# Altium schematic sheet LIN_SCH.SchDoc: Transceiver LIN
size A4; Author: **; CompanyName: Electrónica Aplicada al Automotor; Organization: UTN FRBA; DocumentNumber: 7; Revision: 00; SheetNumber: 7; SheetTotal: 7; Autor: Badenas, Francisco J. / Ipar, Eugenia
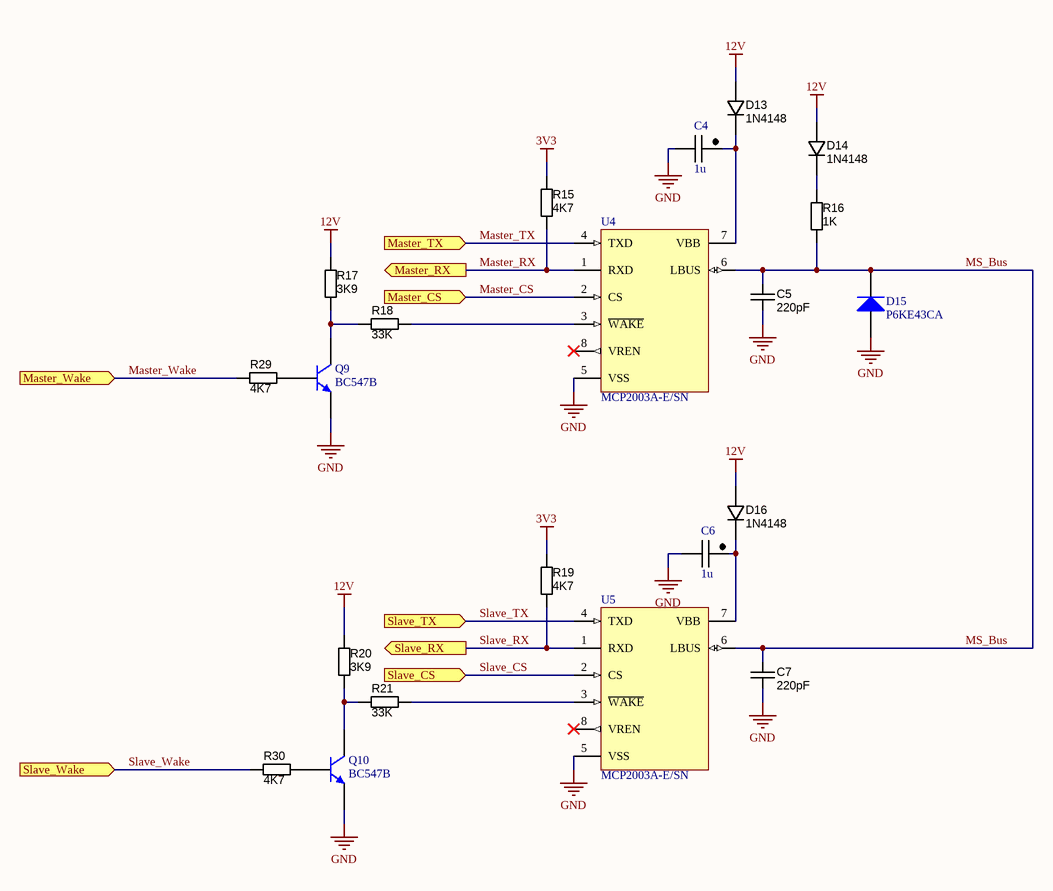
[diagram p0: LIN_SCH.SchDoc]

## Parts
C4  1u  [CAP_Elec_5x5.7]
C5  220pF  [CAPC1608X90N]
C6  1u  [CAP_Elec_5x5.7]
C7  220pF  [CAPC1608X90N]
D13  1N4148  [SOD523F]
D14  1N4148  [SOD523F]
D15  P6KE43CA  [DO-41]
D16  1N4148  [SOD523F]
Q9  BC547B  [TO-92A]
Q10  BC547B  [TO-92A]
R15  4K7  [RESC1608N_ZERO]
R16  1K  [RESC1608N_ZERO]
R17  3K9  [RESC1608N_ZERO]
R18  33K  [RESC1608N_ZERO]
R19  4K7  [RESC1608N_ZERO]
R20  3K9  [RESC1608N_ZERO]
R21  33K  [RESC1608N_ZERO]
R29  4K7  [RESC1608N_ZERO]
R30  4K7  [RESC1608N_ZERO]
U4  MCP2003A-E/SN  [SOIC-SN8_N]
U5  MCP2003A-E/SN  [SOIC-SN8_N]

## Ports
Master_CS (in), Master_RX (out), Master_TX (in), Master_Wake (in), Slave_CS (in), Slave_RX (out), Slave_TX (in), Slave_Wake (in)

## Nets
3V3: R15.1 R19.1
12V: D13.A D14.A D16.A R17.1 R20.1
GND: C4.2 C5.2 C6.2 C7.2 D15.1(A) Q9.1(E) Q10.1(E) U4.5(VSS) U5.5(VSS)
Master_CS: U4.2(CS) ; port Master_CS
Master_RX: R15.2 U4.1(RXD) ; port Master_RX
Master_TX: U4.4(TXD) ; port Master_TX
Master_Wake: R29.1 ; port Master_Wake
MS_Bus: C5.1 C7.1 D15.2(K) R16.2 U4.6(LBUS) U5.6(LBUS)
Slave_CS: U5.2(CS) ; port Slave_CS
Slave_RX: R19.2 U5.1(RXD) ; port Slave_RX
Slave_TX: U5.4(TXD) ; port Slave_TX
Slave_Wake: R30.1 ; port Slave_Wake
NetC4_1: C4.1 D13.K U4.7(VBB)
NetC6_1: C6.1 D16.K U5.7(VBB)
NetD14_K: D14.K R16.1
NetQ9_2: Q9.2(B) R29.2
NetQ9_3: Q9.3(C) R17.2 R18.1
NetQ10_2: Q10.2(B) R30.2
NetQ10_3: Q10.3(C) R20.2 R21.1
NetR18_2: R18.2 U4.3(~{WAKE})
NetR21_2: R21.2 U5.3(~{WAKE})

Not connected (* = marked no-connect by the designer): U4 8(VREN)*; U5 8(VREN)*

## Notes on the sheet
- Title:
- Size:
- Author:
- A4
- Sheet
- of
- Revision:
- File:
- Date:

## Library data of the parts
C4 C6 = CAP_Elec_4x4
C5 C7 = CAPC_47n_0603_X7R_50V_10%: Capacitor SMD Cer 220pF 10% 50V X7R 0603; Manufacturer 1: AVX Corporation; Manufacturer Part Number 1: 06035C473KAT2A; Ratings: 50V; X7R; Material: ceramic; SCDType: spec; Manufacturer 3: Samsung; Manufacturer Part Number 3: CL10B473KBN; Package / Case: 0603 (1608 metric); Tolerance: ±10%; Supplier 1: Digi-Key; Supplier Part Number 1: 478-5146-1-ND; Manufacturer Part Number 2: C1608X7R1H473K080AA; Manufacturer 2: TDK Corporation; ComponentLink1URL: http://www.avx.com/docs/Catalogs/cx7r.pdf; ComponentLink1Description: http://www.avx.com/docs/Catalogs/cx7r.pdf; Supplier 2: Digi-Key; Supplier Part Number 2: 445-1313-1-ND; ComponentLink2URL: http://product.tdk.com/capacitor/mlcc/en/documents/mlcc_commercial_general_en.pdf; ComponentLink2Description: http://product.tdk.com/capacitor/mlcc/en/documents/mlcc_commercial_general_en.pdf; Value: 220pF
D13 D14 D16 = DIODE_1N4148_200mA_SOD523F: Diode 1N4148 SMD SOD-523F; Manufacturer 1: Fairchild Semiconductor; Manufacturer Part Number 1: 1N4148WT; Ratings: Vr=75V; Vf=1V@10mA; Io=200mA; Material: Si; SCDType: source; Package / Case: SC-79, SOD-523F; Supplier 1: Digi-Key; Supplier Part Number 1: 1N4148WTCT-ND; ComponentLink1URL: http://www.fairchildsemi.com/ds/1N/1N914BWT.pdf; ComponentLink1Description: http://www.fairchildsemi.com/ds/1N/1N914BWT.pdf; Value: 1N4148
D15 = Diode 1N4007: 1 Amp General Purpose Rectifier Do-41; Published: 8-Jun-2000; LatestRevisionDate: 17-Jul-2002; LatestRevisionNote: Re-released for DXP Platform.; DatasheetVersion: 1998; PackageVersion: Aug-1999; PackageReference: DO-41; Publisher: Altium Limited; PackageDescription: Diode, Axial; Body 5.2 x 2.7 mm (LxDia. max), Lead Dia. 0.86 mm (max); Code_JEDEC: DO-204-AL; ComponentLink1Description: Manufacturer Link; ComponentLink1URL: http://www.fairchildsemi.com/; ComponentLink2Description: Datasheet; ComponentLink2URL: http://www.fairchildsemi.com/ds/1N%2F1N4001.pdf
Q9 Q10 = 2N3904: NPN General Purpose Amplifier; Published: 8-Jun-2000; LatestRevisionDate: 15-Jan-2003; LatestRevisionNote: PCB Footprint 'BCY-W3/D4.7' replaced; DatasheetVersion: 1997; PackageVersion: Sep-1998; PackageReference: TO-92A; Publisher: Altium Limited; PackageDescription: TO, Flat Index; 3 In-Line, Axial Leads; Body Dia. 4.5mm; Leads 0.51 x 0.48 mm (max); ComponentLink1Description: Manufacturer Link; ComponentLink1URL: http://www.fairchildsemi.com/; ComponentLink2Description: Datasheet; ComponentLink2URL: http://www.fairchildsemi.com/ds/2N%2F2N3904.pdf
R15 R19 R29 R30 = RES_0R_0603: Resistor SMD 0603 4.7K 5%; Manufacturer 1: Vishay/Dale; Manufacturer Part Number 1: CRCW06030000Z0EA; Ratings: 1/10W; SCDType: spec; Tolerance: ±5%; Package / Case: 0603 (1608metric); Supplier 1: Digi-Key; Supplier Part Number 1: 541-0.0GCT-ND; ComponentLink1URL: http://www.vishay.com/doc?20035; ComponentLink1Description: http://www.vishay.com/doc?20035; Supplier 2: Digi-Key; Supplier Part Number 2: P0.0GTR-ND; Manufacturer 2: Panasonic Electronic Components; Manufacturer Part Number 2: ERJ-3GEY0R00V; RoHS 2: RoHS Compliant; ComponentLink2URL: http://industrial.panasonic.com/www-cgi/jvcr13pz.cgi?E+PZ+3+AOA0001+ERJ3GEY0R00V+7+WW; ComponentLink2Description: http://industrial.panasonic.com/www-cgi/jvcr13pz.cgi?E+PZ+3+AOA0001+ERJ3GEY0R00V+7+WW; Supplier 3: Digi-Key; Supplier Part Number 3: 311-0.0LECT-ND; Manufacturer 3: Yageo; Manufacturer Part Number 3: AC0603JR-070RL; RoHS 3: RoHS Compliant; ComponentLink3URL: http://www.yageo.com/documents/recent/PYu-AC_51_RoHS_L_2.pdf; ComponentLink3Description: http://www.yageo.com/documents/recent/PYu-AC_51_RoHS_L_2.pdf; Value: 4K7
R16 = RES_0R_0603: Resistor SMD 0603 1K 5%; Manufacturer 1: Vishay/Dale; Manufacturer Part Number 1: CRCW06030000Z0EA; Ratings: 1/10W; SCDType: spec; Tolerance: ±5%; Package / Case: 0603 (1608metric); Supplier 1: Digi-Key; Supplier Part Number 1: 541-0.0GCT-ND; ComponentLink1URL: http://www.vishay.com/doc?20035; ComponentLink1Description: http://www.vishay.com/doc?20035; Supplier 2: Digi-Key; Supplier Part Number 2: P0.0GTR-ND; Manufacturer 2: Panasonic Electronic Components; Manufacturer Part Number 2: ERJ-3GEY0R00V; RoHS 2: RoHS Compliant; ComponentLink2URL: http://industrial.panasonic.com/www-cgi/jvcr13pz.cgi?E+PZ+3+AOA0001+ERJ3GEY0R00V+7+WW; ComponentLink2Description: http://industrial.panasonic.com/www-cgi/jvcr13pz.cgi?E+PZ+3+AOA0001+ERJ3GEY0R00V+7+WW; Supplier 3: Digi-Key; Supplier Part Number 3: 311-0.0LECT-ND; Manufacturer 3: Yageo; Manufacturer Part Number 3: AC0603JR-070RL; RoHS 3: RoHS Compliant; ComponentLink3URL: http://www.yageo.com/documents/recent/PYu-AC_51_RoHS_L_2.pdf; ComponentLink3Description: http://www.yageo.com/documents/recent/PYu-AC_51_RoHS_L_2.pdf; Value: 1K
R17 R20 = RES_0R_0603: Resistor SMD 0603 3.9K 5%; Manufacturer 1: Vishay/Dale; Manufacturer Part Number 1: CRCW06030000Z0EA; Ratings: 1/10W; SCDType: spec; Tolerance: ±5%; Package / Case: 0603 (1608metric); Supplier 1: Digi-Key; Supplier Part Number 1: 541-0.0GCT-ND; ComponentLink1URL: http://www.vishay.com/doc?20035; ComponentLink1Description: http://www.vishay.com/doc?20035; Supplier 2: Digi-Key; Supplier Part Number 2: P0.0GTR-ND; Manufacturer 2: Panasonic Electronic Components; Manufacturer Part Number 2: ERJ-3GEY0R00V; RoHS 2: RoHS Compliant; ComponentLink2URL: http://industrial.panasonic.com/www-cgi/jvcr13pz.cgi?E+PZ+3+AOA0001+ERJ3GEY0R00V+7+WW; ComponentLink2Description: http://industrial.panasonic.com/www-cgi/jvcr13pz.cgi?E+PZ+3+AOA0001+ERJ3GEY0R00V+7+WW; Supplier 3: Digi-Key; Supplier Part Number 3: 311-0.0LECT-ND; Manufacturer 3: Yageo; Manufacturer Part Number 3: AC0603JR-070RL; RoHS 3: RoHS Compliant; ComponentLink3URL: http://www.yageo.com/documents/recent/PYu-AC_51_RoHS_L_2.pdf; ComponentLink3Description: http://www.yageo.com/documents/recent/PYu-AC_51_RoHS_L_2.pdf; Value: 3K9
R18 R21 = RES_0R_0603: Resistor SMD 0603 33K 5%; Manufacturer 1: Vishay/Dale; Manufacturer Part Number 1: CRCW06030000Z0EA; Ratings: 1/10W; SCDType: spec; Tolerance: ±5%; Package / Case: 0603 (1608metric); Supplier 1: Digi-Key; Supplier Part Number 1: 541-0.0GCT-ND; ComponentLink1URL: http://www.vishay.com/doc?20035; ComponentLink1Description: http://www.vishay.com/doc?20035; Supplier 2: Digi-Key; Supplier Part Number 2: P0.0GTR-ND; Manufacturer 2: Panasonic Electronic Components; Manufacturer Part Number 2: ERJ-3GEY0R00V; RoHS 2: RoHS Compliant; ComponentLink2URL: http://industrial.panasonic.com/www-cgi/jvcr13pz.cgi?E+PZ+3+AOA0001+ERJ3GEY0R00V+7+WW; ComponentLink2Description: http://industrial.panasonic.com/www-cgi/jvcr13pz.cgi?E+PZ+3+AOA0001+ERJ3GEY0R00V+7+WW; Supplier 3: Digi-Key; Supplier Part Number 3: 311-0.0LECT-ND; Manufacturer 3: Yageo; Manufacturer Part Number 3: AC0603JR-070RL; RoHS 3: RoHS Compliant; ComponentLink3URL: http://www.yageo.com/documents/recent/PYu-AC_51_RoHS_L_2.pdf; ComponentLink3Description: http://www.yageo.com/documents/recent/PYu-AC_51_RoHS_L_2.pdf; Value: 33K
U4 U5 = CMP-0186-00221-1: LIN J2602 Transceiver, 8-Pin SOIC, Extended Temperature; Code_IPC: SOIC127P600-8; ComponentLink1URL: http://www.microchip.com/; Code_JEDEC: MS-012; PackageReference: SOIC-SN8; ComponentLink1Description: Manufacturer URL; DatasheetVersion: revD, Dec-2011; PackageVersion: revBB, Aug-2009; ComponentLink3URL: http://www.microchip.com/stellent/groups/techpub_sg/documents/packagingspec/en012702.pdf; ComponentLink2Description: Datasheet; ComponentLink3Description: Package Specification; ComponentLink2URL: http://ww1.microchip.com/downloads/en/DeviceDoc/22230D.pdf; PackageDescription: 8-Lead Plastic Small Outline (SN) - Narrow, 3.90mm Body [SOIC]